# EAGLE design untitled (EAGLE 9.6.2)
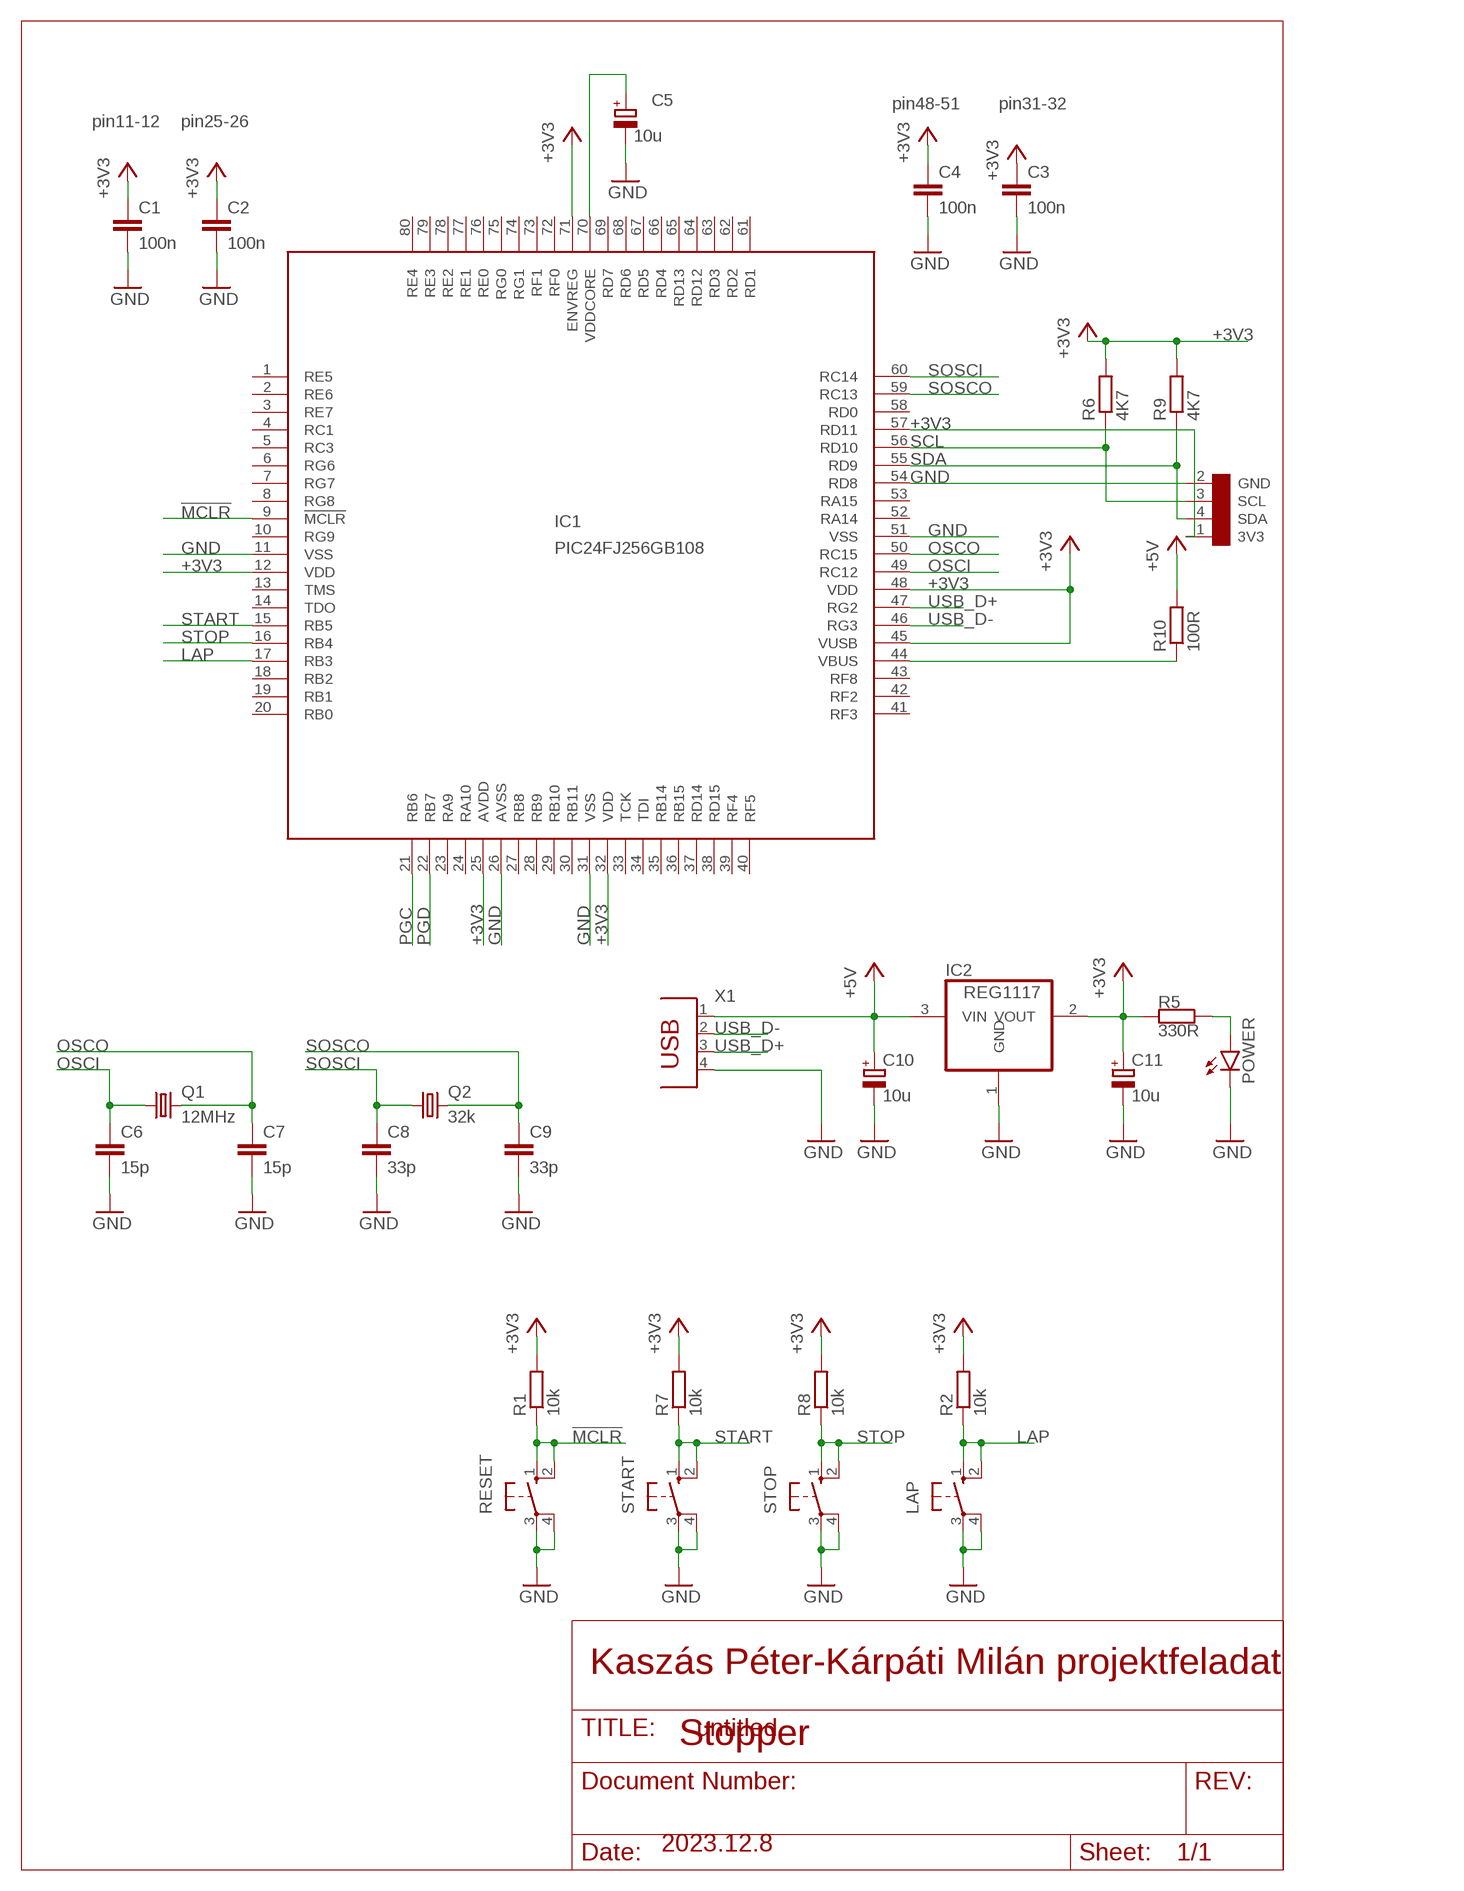
[diagram p0: schematic, sheet 1]
STOPPER (DINA4_P): TITLE: Stopper

## Parts
C1  100n  C-EUC1206  [C1206]
C2  100n  C-EUC1206  [C1206]
C3  100n  C-EUC1206  [C1206]
C4  100n  C-EUC1206  [C1206]
C5  10u  CPOL-EUSMCD  [SMC_D]
C6  15p  C-EUC1206  [C1206]
C7  15p  C-EUC1206  [C1206]
C8  33p  C-EUC1206  [C1206]
C9  33p  C-EUC1206  [C1206]
C10  10u  CPOL-EUSMCD  [SMC_D]
C11  10u  CPOL-EUSMCD  [SMC_D]
CON1  ICSPI2CTUSKE  [HDRV4W64P254_1X4_1016X508X838B]
IC1  PIC24FJ256GB108  [TQFP80-12X12]
IC2  REG1117  [SOT223]
LAP  10-XX  [B3F-10XX]
POWER  LED5MM  [LED5MM]
Q1  12MHz  CRYSTALHC49U70  [HC49U70]
Q2  32k  CRYSTALTC26H  [TC26H]
R1  10k  R-EU_R1206  [R1206]
R2  10k  R-EU_R1206  [R1206]
R5  330R  R-EU_R1206  [R1206]
R6  4K7  R-EU_R1206  [R1206]
R7  10k  R-EU_R1206  [R1206]
R8  10k  R-EU_R1206  [R1206]
R9  4K7  R-EU_R1206  [R1206]
R10  100R  R-EU_R1206  [R1206]
RESET  10-XX  [B3F-10XX]
START  10-XX  [B3F-10XX]
STOP  10-XX  [B3F-10XX]
X1  PN61729  [PN61729]

## Nets
!MCLR: IC1.9(!MCLR) R1.1 RESET.1(S) RESET.2(S1)
+3V3 [power]: C1.1 C2.1 C3.1 C4.1 C11.+ CON1.1(3V3) IC1.12(VDD) IC1.25(AVDD) IC1.32(VDD) IC1.45(VUSB) IC1.48(VDD) IC1.57(RD11) IC1.71(ENVREG) IC2.2(VOUT) R1.2 R2.2 R5.2 R6.2 R7.2 R8.2 R9.2
+5V [power]: C10.+ IC2.3(VIN) R10.2 X1.1
GND [power]: C1.2 C2.2 C3.2 C4.2 C5.- C6.2 C7.2 C8.2 C9.2 C10.- C11.- CON1.2(GND) IC1.11(VSS) IC1.26(AVSS) IC1.31(VSS) IC1.51(VSS) IC1.54(RD8) IC2.1(GND) LAP.3(P) LAP.4(P1) POWER.K(C) RESET.3(P) RESET.4(P1) START.3(P) START.4(P1) STOP.3(P) STOP.4(P1) X1.4
LAP: IC1.17(RB3) LAP.1(S) LAP.2(S1) R2.1
N$1: C5.+ IC1.70(VDDCORE)
N$2: POWER.A R5.1
N$6: IC1.44(VBUS) R10.1
OSCI: C6.1 IC1.49(RC12) Q1.1
OSCO: C7.1 IC1.50(RC15) Q1.2
PGC: IC1.21(RB6)
PGD: IC1.22(RB7)
SCL: CON1.3(SCL) IC1.56(RD10) R6.1
SDA: CON1.4(SDA) IC1.55(RD9) R9.1
SOSCI: C8.1 IC1.60(RC14) Q2.1
SOSCO: C9.1 IC1.59(RC13) Q2.2
START: IC1.15(RB5) R7.1 START.1(S) START.2(S1)
STOP: IC1.16(RB4) R8.1 STOP.1(S) STOP.2(S1)
USB_D+: IC1.47(RG2) X1.3
USB_D-: IC1.46(RG3) X1.2
Unconnected: IC1.1(RE5) IC1.2(RE6) IC1.3(RE7) IC1.4(RC1) IC1.5(RC3) IC1.6(RG6) IC1.7(RG7) IC1.8(RG8) IC1.10(RG9) IC1.13(TMS) IC1.14(TDO) IC1.18(RB2) IC1.19(RB1) IC1.20(RB0) IC1.23(RA9) IC1.24(RA10) IC1.27(RB8) IC1.28(RB9) IC1.29(RB10) IC1.30(RB11) IC1.33(TCK) IC1.34(TDI) IC1.35(RB14) IC1.36(RB15) IC1.37(RD14) IC1.38(RD15) IC1.39(RF4) IC1.40(RF5) IC1.41(RF3) IC1.42(RF2) IC1.43(RF8) IC1.52(RA14) IC1.53(RA15) IC1.58(RD0) IC1.61(RD1) IC1.62(RD2) IC1.63(RD3) IC1.64(RD12) IC1.65(RD13) IC1.66(RD4) IC1.67(RD5) IC1.68(RD6) IC1.69(RD7) IC1.72(RF0) IC1.73(RF1) IC1.74(RG1) IC1.75(RG0) IC1.76(RE0) IC1.77(RE1) IC1.78(RE2) IC1.79(RE3) IC1.80(RE4)

## Notes on the sheet
- pin48-51 | pin31-32
- pin11-12 | pin25-26
- Kaszás Péter-Kárpáti Milán projektfeladat
- Stopper
- 2023.12.8

## Library data of the parts
C1-C4 C6-C9 = rcl:C-EU: CAPACITOR, European symbol; SPICEPREFIX: C
C5 C10 C11 = rcl:CPOL-EU: POLARIZED CAPACITOR, European symbol; SPICEPREFIX: C
CON1 = I2C:ICSP
IC1 = microchip:PIC24FJ256GB108: PIC24FJ256GB108 edit this description Auto generated by make-symbol-device-package-bsdl.ulp Rev. 25 Source: PIC24FJ256GB108.bsd; MPN: PIC24FJ256GB108-I/PT; OC_FARNELL: 1576869; OC_NEWARK: 54M5131
IC2 = burr-brown:REG1117: 800mA and 1A Low Dropout (LDO) Positive Regulator 1.8V, 2.5V, 2.85V, 3.3V, 5V, and Adj; MPN: REG1117; OC_FARNELL: 1097566; OC_NEWARK: 14P6981
LAP RESET START STOP = switch-omron:10-XX: OMRON SWITCH; MPN: B3F-1000; OC_FARNELL: 176432; OC_NEWARK: 36M3542
POWER = led:LED: LED OSRAM: - CHIPLED LG R971, LG N971, LY N971, LG Q971, LY Q971, LO R971, LY R971 LH N974, LH R974 LS Q976, LO Q976, LY Q976 LO Q996 - Hyper CHIPLED LW Q18S LB Q993, LB Q99A, LB R99A - SideLED LS A670, LO A670, LY A670, LG A670, LP A670 LB A673, LV A673, LT A673, LW A673 LH A674 LY A675 LS A676, LA A676, LO A676, LY A676, LW A676 LS A679, LY A679, LG A679 - Hyper Micro SIDELED® LS Y876, LA Y876, LO Y876, LY Y876 LT Y87S - SmartLED LW L88C, LW L88S LB L89C, LB L89S, LG L890 LS L89K, LO L89K, LY L89K LS L896, LA L896, LO L896, LY L896 - TOPLED LS T670, LO T670, LY T670, LG T670, LP T670 LSG T670, LSP T670, LSY T670, LOP T670, LYG T670 LG T671, LOG T671, LSG T671 LB T673, LV T673, LT T673, LW T673 LH T674 LS T676, LA T676, LO T676, LY T676, LB T676, LH T676, LSB T676, LW T676 LB T67C, LV T67C, LT T67C, LS T67K, LO T67K, LY T67K, LW E67C LS E67B, LA E67B, LO E67B, LY E67B, LB E67C, LV E67C, LT E67C LW T67C LS T679, LY T679, LG T679 LS T770, LO T770, LY T770, LG T770, LP T770 LB T773, LV T773, LT T773, LW T773 LH T774 LS E675, LA E675, LY E675, LS T675 LS T776, LA T776, LO T776, LY T776, LB T776 LHGB T686 LT T68C, LB T68C - Hyper Mini TOPLED® LB M676 - Mini TOPLED Santana® LG M470 LS M47K, LO M47K, LY M47K Source: http://www.osram.convergy.de LUXEON: - LUMILED® LXK2-PW12-R00, LXK2-PW12-S00, LXK2-PW14-U00, LXK2-PW14-V00 LXK2-PM12-R00, LXK2-PM12-S00, LXK2-PM14-U00 LXK2-PE12-Q00, LXK2-PE12-R00, LXK2-PE12-S00, LXK2-PE14-T00, LXK2-PE14-U00 LXK2-PB12-K00, LXK2-PB12-L00, LXK2-PB12-M00, LXK2-PB14-N00, LXK2-PB14-P00, LXK2-PB14-Q00 LXK2-PR12-L00, LXK2-PR12-M00, LXK2-PR14-Q00, LXK2-PR14-R00 LXK2-PD12-Q00, LXK2-PD12-R00, LXK2-PD12-S00 LXK2-PH12-R00, LXK2-PH12-S00 LXK2-PL12-P00, LXK2-PL12-Q00, LXK2-PL12-R00 Source: www.luxeon.com KINGBRIGHT: KA-3528ASYC Source: www.kingbright.com
Q1 Q2 = crystal:CRYSTAL: CRYSTAL; OC_FARNELL: unknown; OC_NEWARK: unknown
R1 R2 R5-R10 = rcl:R-EU_: RESISTOR, European symbol; SPICEPREFIX: R
X1 = con-berg:PN61729: BERG USB connector; OC_FARNELL: unknown; OC_NEWARK: unknown

## Net classes
0 default: width 0.254 mm, clearance 0.203 mm
1 power: width 0.406 mm, clearance 0.203 mm

## Board
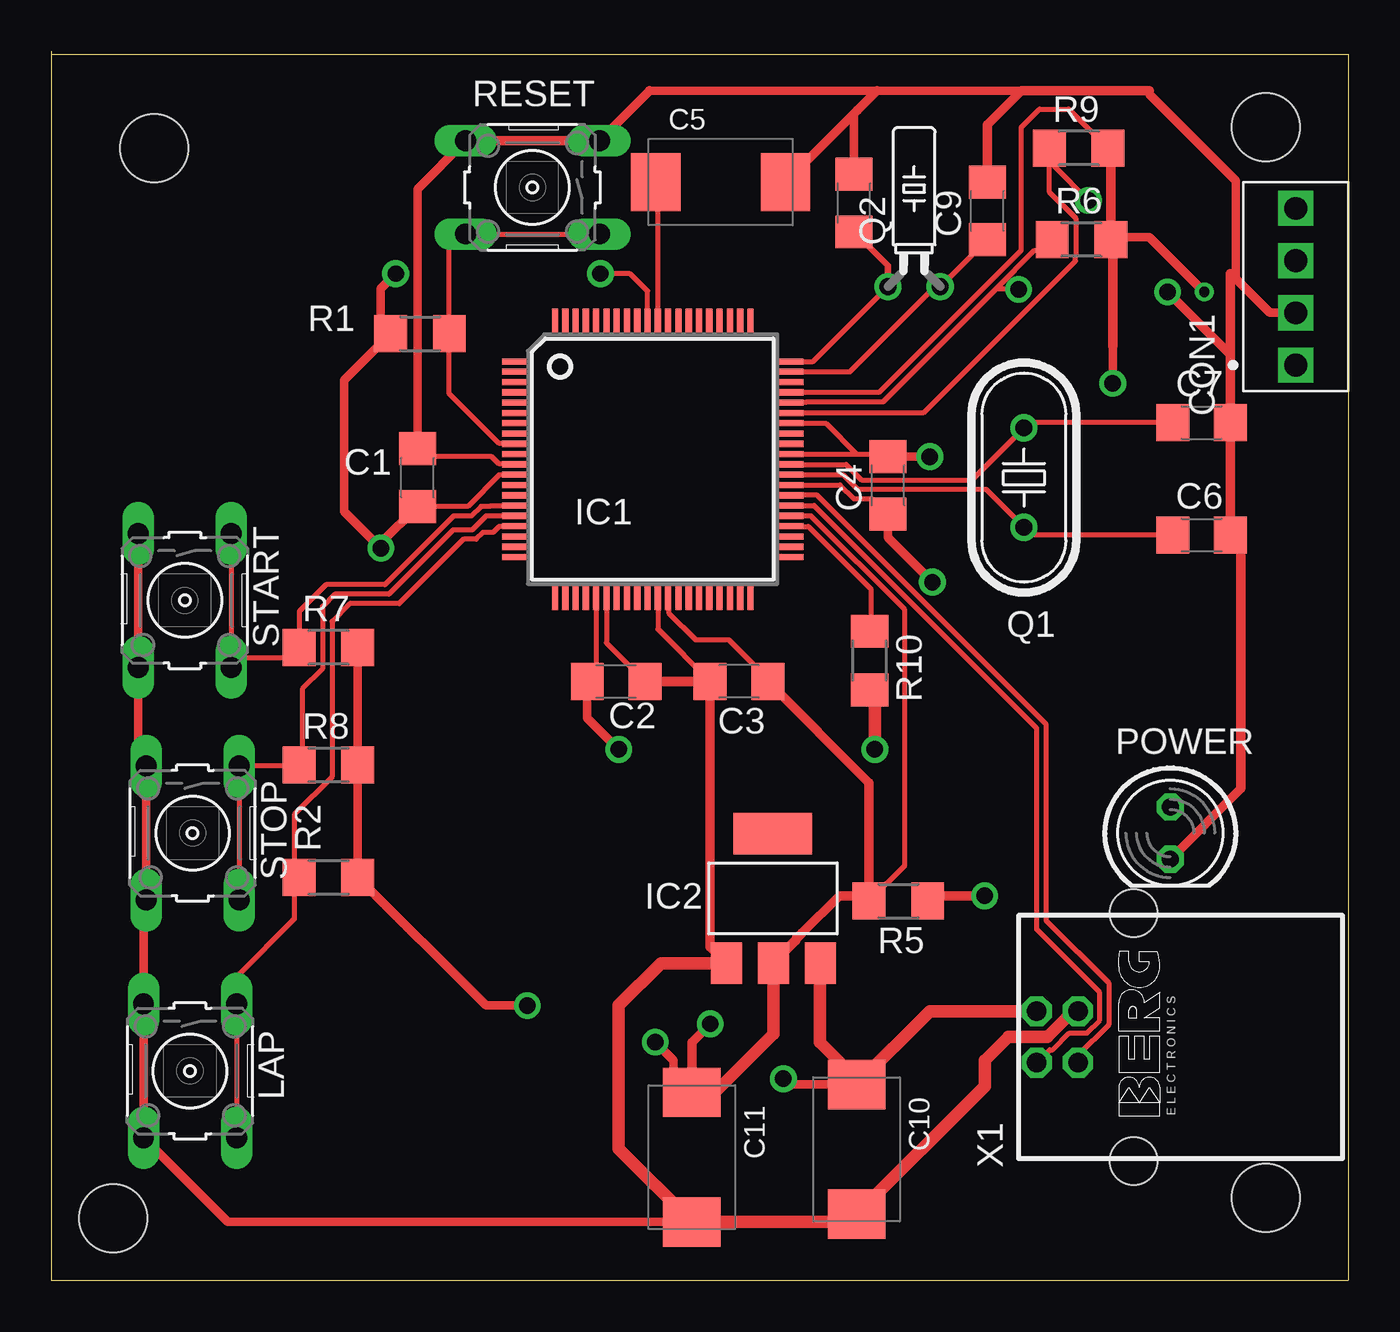
[diagram p1: board, top side]
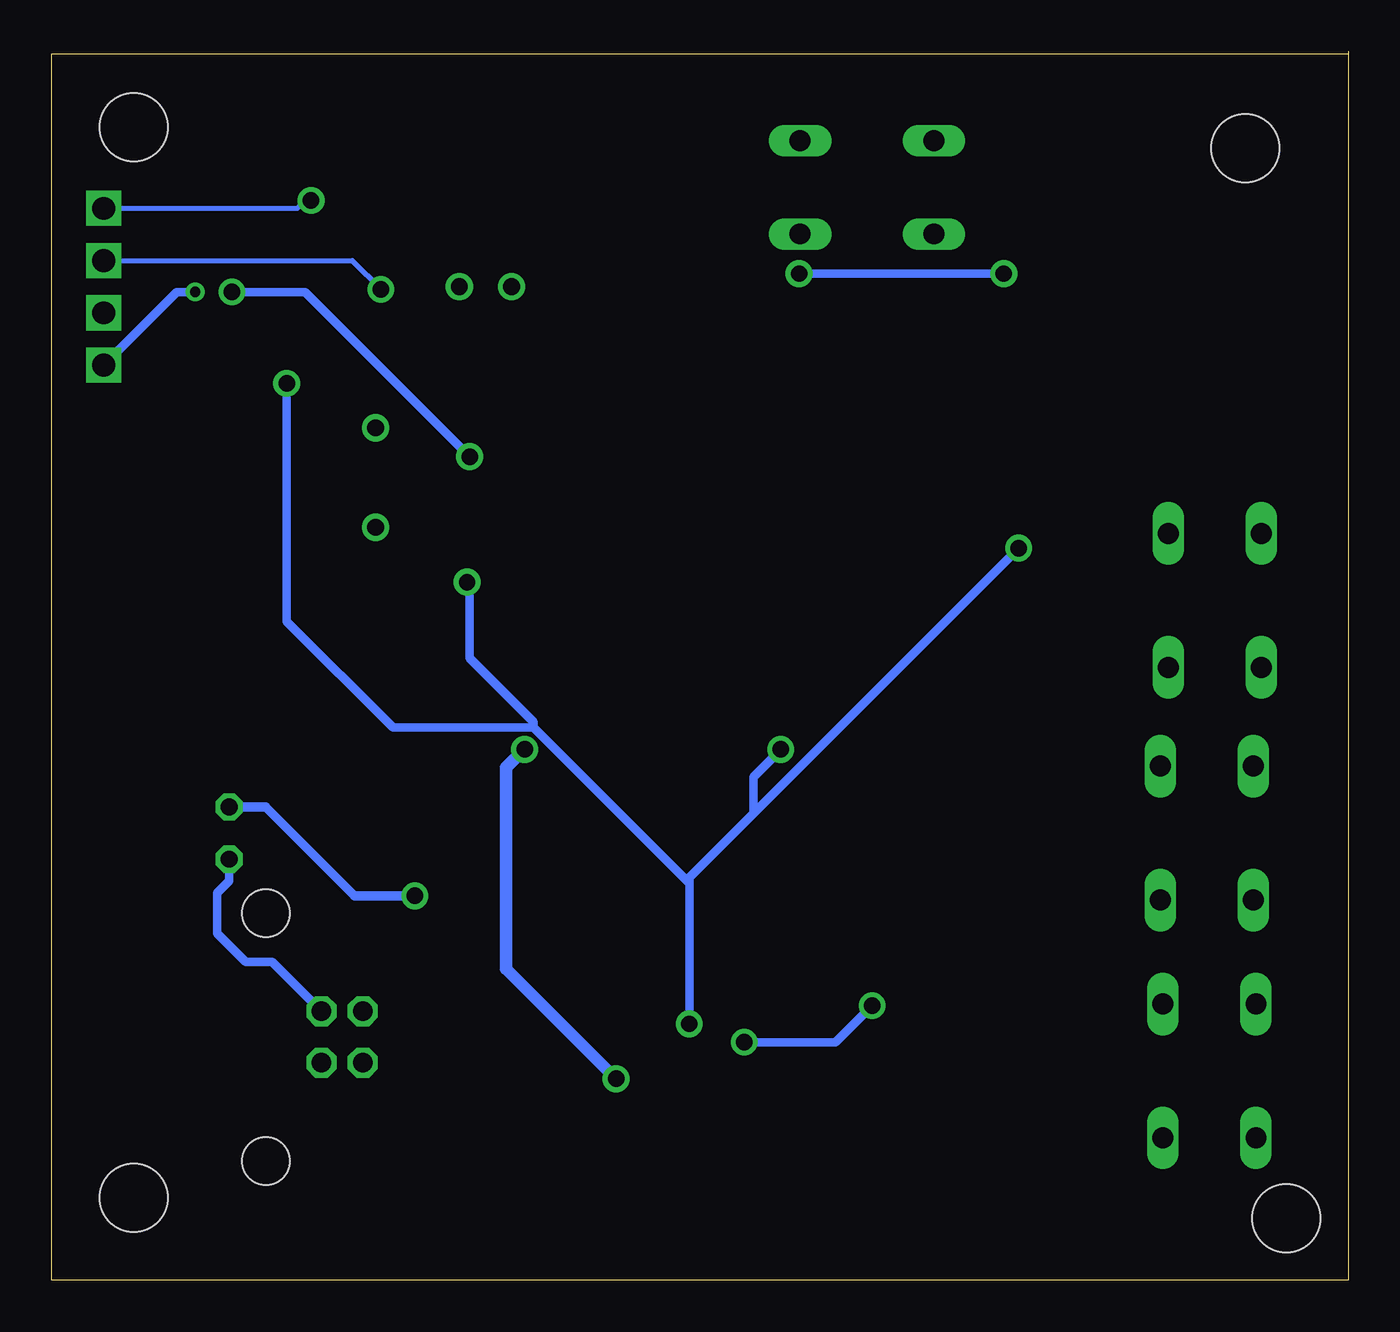
[diagram p2: board, bottom side, seen from below]

Size 62.99 x 59.69 mm. Coordinates in mm from the lower left corner, seen from the top.
Outline: 0,59.69 0,59.56
Outline: 0,59.56 0,0 62.99,0 62.99,59.56 0,59.56
Copper layers (1*16): Top 0.035mm / dielectric 1.5mm / Bottom 0.035mm
Design rules "default *": minimum track width 10mil, minimum drill 0.5mm, track to track 8mil, track to pad 8mil, pad to pad 8mil, via to via 8mil, smd to smd 8mil, copper to edge 40mil, drill to drill 6mil, minimum pad ring 10mil, minimum via ring 8mil, stop-mask expansion 4mil, vias tented up to drill 0mil, thermal gap 20mil
Holes 3.3 mm at 5,55 59,4 59,56 3,3

### Footprints (pad centres in the part's own frame; a part is rotated, then mirrored left to right if it is on the bottom)
C1206 = smd 1.6 x 1.8: 1 -1.4,0; 2 1.4,0
SMC_D = smd 2.4 x 2.8: + -3.15,0; - 3.15,0
HDRV4W64P254_1X4_1016X508X838B = drill 1.105 pad 1.705 square: 1 0,0; 2 2.54,0; 3 5.08,0; 4 7.62,0
TQFP80-12X12 = smd 1.2 x 0.3: 1 -6.725,4.75; 2 -6.725,4.25; 3 -6.725,3.75; 4 -6.725,3.25; 5 -6.725,2.75; 6 -6.725,2.25; 7 -6.725,1.75; 8 -6.725,1.25; 9 -6.725,0.75; 10 -6.725,0.25; 11 -6.725,-0.25; 12 -6.725,-0.75; 13 -6.725,-1.25; 14 -6.725,-1.75; 15 -6.725,-2.25; 16 -6.725,-2.75; 17 -6.725,-3.25; 18 -6.725,-3.75; 19 -6.725,-4.25; 20 -6.725,-4.75; 41 6.725,-4.75; 42 6.725,-4.25; 43 6.725,-3.75; 44 6.725,-3.25; 45 6.725,-2.75; 46 6.725,-2.25; 47 6.725,-1.75; 48 6.725,-1.25; 49 6.725,-0.75; 50 6.725,-0.25; 51 6.725,0.25; 52 6.725,0.75; 53 6.725,1.25; 54 6.725,1.75; 55 6.725,2.25; 56 6.725,2.75; 57 6.725,3.25; 58 6.725,3.75; 59 6.725,4.25; 60 6.725,4.75 | smd 0.3 x 1.2: 21 -4.75,-6.725; 22 -4.25,-6.725; 23 -3.75,-6.725; 24 -3.25,-6.725; 25 -2.75,-6.725; 26 -2.25,-6.725; 27 -1.75,-6.725; 28 -1.25,-6.725; 29 -0.75,-6.725; 30 -0.25,-6.725; 31 0.25,-6.725; 32 0.75,-6.725; 33 1.25,-6.725; 34 1.75,-6.725; 35 2.25,-6.725; 36 2.75,-6.725; 37 3.25,-6.725; 38 3.75,-6.725; 39 4.25,-6.725; 40 4.75,-6.725; 61 4.75,6.725; 62 4.25,6.725; 63 3.75,6.725; 64 3.25,6.725; 65 2.75,6.725; 66 2.25,6.725; 67 1.75,6.725; 68 1.25,6.725; 69 0.75,6.725; 70 0.25,6.725; 71 -0.25,6.725; 72 -0.75,6.725; 73 -1.25,6.725; 74 -1.75,6.725; 75 -2.25,6.725; 76 -2.75,6.725; 77 -3.25,6.725; 78 -3.75,6.725; 79 -4.25,6.725; 80 -4.75,6.725
SOT223 = smd 1.499 x 2.007: 1 -2.261,-3.15; 2 0.025,-3.15; 3 2.311,-3.15 | smd 3.81 x 2.007: 4 0,3.15
B3F-10XX = drill 1.016 long: 1 -3.251,2.261; 2 3.251,2.261; 3 -3.251,-2.261; 4 3.251,-2.261
LED5MM = drill 0.813 octagon: A -1.27,0; K 1.27,0
HC49U70 = drill 0.813: 1 -2.413,0; 2 2.413,0
TC26H = drill 0.813: 1 -1.27,0; 2 1.27,0
R1206 = smd 1.6 x 1.803: 1 -1.422,0; 2 1.422,0
PN61729 = drill 0.95 octagon: 1 1.25,4.71; 2 -1.25,4.71; 3 -1.25,2.71; 4 1.25,2.71 | hole 2.3: -6.02,0; 6.02,0

### Placement (x,y rotation side)
C1  17.78,38.99 90 top
C2  27.43,29.08 0 top
C3  33.4,29.08 180 top
C4  40.64,38.61 90 top
C5  32.51,53.34 0 top
C6  55.88,36.2 0 top
C7  55.88,41.66 0 top
C8  38.99,52.32 90 top
C9  45.47,51.94 90 top
C10  39.12,6.35 270 top
C11  31.11,5.97 270 top
CON1  60.45,44.45 90 top
IC1  29.21,39.88 0 top
IC2  35.05,18.54 0 top
LAP  6.73,10.16 270 top
POWER  54.36,21.72 270 top
Q1  47.24,38.99 90 top
Q2  41.91,48.26 0 top
R1  17.91,45.97 180 top
R2  13.46,19.56 0 top
R5  41.15,18.41 180 top
R6  50.04,50.55 0 top
R7  13.46,30.73 0 top
R8  13.46,25.02 0 top
R9  49.91,54.99 0 top
R10  39.75,30.1 270 top
RESET  23.37,53.09 180 top
START  6.48,33.02 270 top
STOP  6.86,21.72 270 top
X1  52.58,11.81 90 top

### Tracks (layer width: path | path; a pad name or v marks a point on that pad's centre or on a via)
!MCLR
  Top 0.254: IC1.9 22.46,40.65 21.75,40.65 19.33,43.07 R1.1 19.33,50.6 19.56,50.83 RESET.2 RESET.1
+3V3  (via drill 0.5, 0.8 pad 1.3)
  Top 0.254: C1.1 20.23,37.59 21.77,39.13 IC1.12 | IC1.25 26.46,29.51 C2.1 | IC1.48 38.31,38.63 38.98,37.96 39.88,37.96 C4.1 | IC1.32 29.98,33.13 29.98,32.42 31.28,31.11 32.89,31.11 34.8,29.21 C3.1 | R5.2 41.46,20.15 41.46,32.57 36.9,37.13 IC1.45 | v26.67,48.9 28.11,48.9 28.96,48.05 IC1.71 | IC1.57 35.95,43.15 40.24,43.15 47.12,50.03 47.12,56.01 48.01,56.9 49.43,56.9 R9.2
  Top 0.406: C1.1 16,35.81 v16,35.56 14.22,37.34 14.22,43.71 R1.2 16,46.46 16,48.17 v16.72,48.9 | C11.+ 30.23,10.01 30.23,10.67 v29.34,11.56 | v27.56,25.78 26.03,27.31 C2.1 | v51.56,43.56 51.56,45.34 | v42.8,33.91 40.64,36.07 C4.1 | 36.47,16.87 36.47,16.83 35.08,15.43 IC2.2 | v23.11,13.34 21.11,13.34 R2.2 R8.2 R7.2 | v56.01,48.01 53.34,50.67 51.59,50.67 R6.2
  Top 0.457: IC2.2 36.18,16.5 36.18,16.57 36.47,16.87 38.28,18.67 39.47,18.67 R5.2 39.73,24.16 C3.1 | C11.+ 31.11,11.56 v32,12.45 | R9.2 51.46,54.86 R6.2 51.56,50.44 51.56,45.34
  Top 0.61: C11.+ 32.23,9.12 35.08,11.96 IC2.2
  Bottom 0.406: 28.89,22.67 32,19.56 v32,12.45 32,19.27 39.57,26.84 | 28.89,22.67 v16,35.56 | v16.72,48.9 v26.67,48.9 | 39.57,26.84 46.4,26.84 51.56,32 v51.56,43.56 | 28.89,22.67 28.89,24.45 v27.56,25.78 | 39.57,26.84 39.57,27.12 42.67,30.23 42.67,33.78 v42.8,33.91 | v29.34,11.56 24.89,11.56 v23.11,13.34 | CON1.1 56.9,48.01 v56.01,48.01
+5V  (via drill 0.8 pad 1.3)
  Top 0.406: 35.84,9.5 C10.+
  Top 0.457: C10.+ 39.12,9.78
  Top 0.61: 39.12,9.78 37.34,11.56 37.34,15.37 IC2.3 | 35.84,9.5 v35.56,9.78 | R10.2 40.01,28.42 v40.01,25.78 | X1.1 42.68,13.06 C10.+
  Bottom 0.61: v35.56,9.78 40.89,15.11 40.89,24.89 v40.01,25.78
GND  (via drill 0.8 pad 1.3)
  Top 0.254: IC1.51 39.12,40.13 | 39.12,40.13 40.52,40.13 C4.2 | IC1.11 22.46,39.65 21.75,39.65 21.39,40.01 18.16,40.01 C1.2 | IC1.26 26.96,30.95 C2.2 | IC1.31 29.46,31.62 C3.2 | IC1.54 37.62,41.63 39.12,40.13
  Top 0.406: 47.12,57.78 40.11,57.78 29.06,57.78 | C1.2 17.78,53.01 RESET.4 | C4.2 v42.67,40.01 | v54.23,48.01 57.28,44.95 57.28,44.45 | C8.2 38.99,56.67 | 38.99,56.67 39.17,56.84 | C5.- 38.99,56.67 | C11.- 8.56,2.82 LAP.4 LAP.3 4.47,18.34 STOP.4 STOP.3 4.22,25.35 START.4 START.3 | 57.28,48.9 57.53,48.64 | 57.53,48.64 59.19,46.99 CON1.2 | 57.53,48.64 57.53,53.41 53.34,57.6 53.34,57.78
  Top 0.457: C10.- 38.73,2.82 | C2.2 C3.2 32,16.18 IC2.1 | C9.2 45.47,56.13 47.12,57.78 53.34,57.78 | RESET.4 RESET.3 29.06,57.78 | 57.28,48.9 57.28,44.45 C7.2 C6.2 57.78,35.69 57.78,23.88 POWER.K | 39.17,56.84 40.11,57.78
  Top 0.61: 38.73,2.82 C11.- 27.56,6.38 27.56,13.34 29.62,15.39 IC2.1 | X1.4 49.62,13.06 48.38,11.82 46.49,11.82 45.34,10.67 45.34,9.42 C10.-
  Bottom 0.406: v42.67,40.01 50.67,48.01 v54.23,48.01 | X1.4 52.27,15.46 53.56,15.46 54.95,16.85 54.95,18.81 54.36,19.4 POWER.K
LAP
  Top 0.254: IC1.17 22.46,36.61 21.75,36.61 21.46,36.32 20.97,36.32 20.64,35.99 20.02,35.99 16.89,32.87 14.49,32.87 13.63,32 13.63,24.44 11.8,22.61 11.8,19.32 | R2.1 11.8,19.32 | LAP.2 LAP.1 8.99,14.73 11.8,17.54 11.8,19.32
N$1
  Top 0.254: IC1.70 29.46,53.24 C5.+
N$2  (via drill 0.8 pad 1.3)
  Top 0.457: R5.1 42.82,18.67 v45.34,18.67
  Bottom 0.457: POWER.A 52.58,22.99 48.26,18.67 v45.34,18.67
N$6
  Top 0.254: IC1.44 35.95,36.61 36.77,36.61 39.8,33.58 39.8,31.57 R10.1
OSCI
  Top 0.254: IC1.49 38.46,39.13 39.16,38.42 45.4,38.42 Q1.1 47.62,36.2 C6.1
OSCO
  Top 0.254: Q1.2 44.72,38.88 39.35,38.88 38.6,39.63 IC1.50 | C7.1 47.5,41.66
  Top 0.457: 47.5,41.66 Q1.2
SCL  (via drill 0.8 pad 1.3)
  Top 0.254: IC1.56 35.95,42.65 36.67,42.65 36.7,42.67 40.41,42.67 45.87,48.13 | 45.87,48.13 47.76,50.03 48.1,50.03 R6.1 | v46.99,48.13 45.87,48.13
  Bottom 0.254: CON1.3 48.38,49.53 v46.99,48.13
SDA  (via drill 0.8 pad 1.3)
  Top 0.254: IC1.55 35.95,42.15 42.39,42.15 49.75,49.51 49.75,49.75 49.78,49.78 49.78,51.56 48.49,52.86 R9.1 48.49,54.34 48.75,54.08 v50.38,52.45
  Bottom 0.254: CON1.4 51.05,52.07 50.67,52.45 v50.38,52.45
SOSCI
  Top 0.254: IC1.60 37.01,44.63 Q2.1
  Top 0.305: Q2.1 40.64,49.27 C8.1
SOSCO
  Top 0.254: IC1.59 38.79,44.13 42.93,48.26 Q2.2 C9.1
START
  Top 0.254: IC1.15 22.46,37.61 21.34,37.61 21.31,37.59 20.87,37.59 20.42,37.13 19.56,37.13 16.21,33.78 13.34,33.78 12.04,32.49 R7.1 11.53,30.23 8.74,30.23 | START.1 8.74,30.23 | 8.74,30.23 START.2
STOP
  Top 0.254: IC1.16 21.13,37.13 20.45,36.45 19.52,36.45 16.4,33.33 13.77,33.33 13.17,32.73 13.17,29.7 12.18,28.7 12.18,25.16 R8.1 11.99,24.97 STOP.1 STOP.2
USB_D+
  Top 0.254: IC1.47 37.2,38.13 48.33,27 48.33,17.46 51.38,14.4 51.38,12.43 49.87,10.92 X1.3
USB_D-
  Top 0.254: IC1.46 37.05,37.63 47.87,26.81 47.87,17.03 50.93,13.97 50.93,12.62 50.31,12 49.46,12 48.64,11.19 48.5,11.19 X1.2